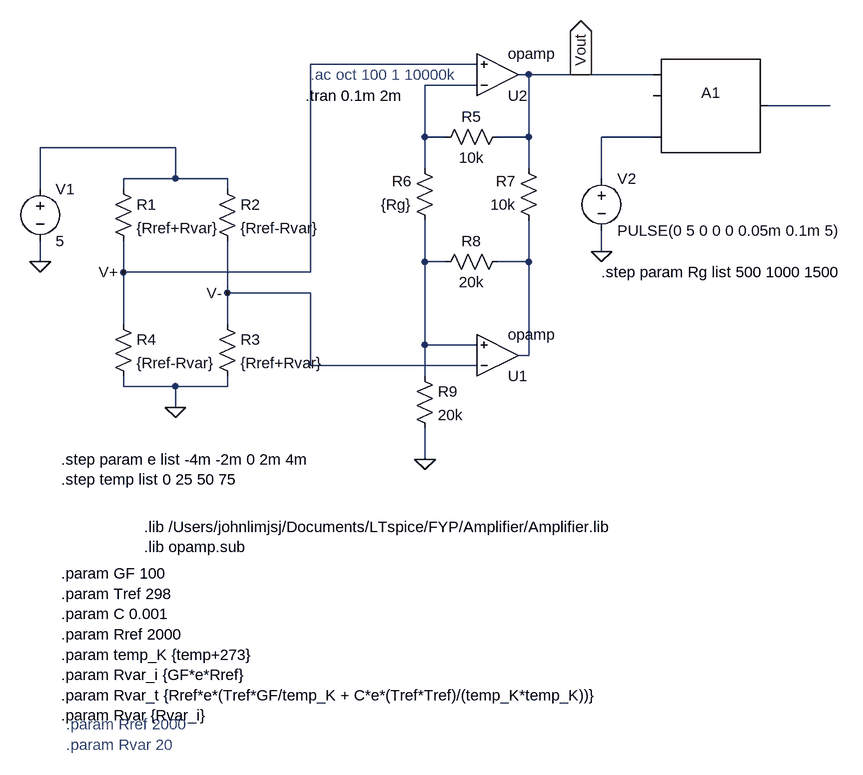
[diagram p0: schematic PZR_INA.asc]
PZR_INA.asc, the LTspice schematic file:
Version 4
SHEET 1 1700 1020
WIRE 704 -32 448 -32
WIRE 784 -16 768 -16
WIRE 864 -16 784 -16
WIRE 976 -16 864 -16
WIRE 704 0 624 0
WIRE 1248 32 1152 32
WIRE 624 80 624 0
WIRE 656 80 624 80
WIRE 784 80 784 -16
WIRE 784 80 736 80
WIRE 976 80 896 80
WIRE 240 96 32 96
WIRE 624 128 624 80
WIRE 784 128 784 80
WIRE 240 144 240 96
WIRE 240 144 160 144
WIRE 320 144 240 144
WIRE 896 144 896 80
WIRE 32 160 32 96
WIRE 160 160 160 144
WIRE 320 160 320 144
WIRE 896 256 896 224
WIRE 32 272 32 240
WIRE 624 272 624 208
WIRE 656 272 624 272
WIRE 784 272 784 208
WIRE 784 272 736 272
WIRE 160 288 160 240
WIRE 448 288 448 -32
WIRE 448 288 160 288
WIRE 320 320 320 240
WIRE 448 320 320 320
WIRE 160 368 160 288
WIRE 320 368 320 320
WIRE 624 400 624 272
WIRE 704 400 624 400
WIRE 784 416 784 272
WIRE 784 416 768 416
WIRE 448 432 448 320
WIRE 704 432 448 432
WIRE 624 448 624 400
WIRE 160 464 160 448
WIRE 240 464 160 464
WIRE 320 464 320 448
WIRE 320 464 240 464
WIRE 240 496 240 464
WIRE 624 576 624 528
FLAG 32 272 0
FLAG 624 576 0
FLAG 864 -16 Vout
IOPIN 864 -16 Out
FLAG 240 496 0
FLAG 160 288 V+
FLAG 320 320 V-
FLAG 896 256 0
SYMBOL res 144 144 R0
SYMATTR InstName R1
SYMATTR Value {Rref+Rvar}
SYMBOL res 304 144 R0
SYMATTR InstName R2
SYMATTR Value {Rref-Rvar}
SYMBOL res 304 352 R0
SYMATTR InstName R3
SYMATTR Value {Rref+Rvar}
SYMBOL res 144 352 R0
SYMATTR InstName R4
SYMATTR Value {Rref-Rvar}
SYMBOL voltage 32 144 R0
SYMATTR InstName V1
SYMATTR Value 5
SYMATTR Value2 AC 10
SYMBOL Opamps/opamp 736 480 M180
SYMATTR InstName U1
SYMBOL Opamps/opamp 736 48 M180
SYMATTR InstName U2
SYMBOL res 752 64 R90
WINDOW 0 0 56 VBottom 2
WINDOW 3 32 56 VTop 2
SYMATTR InstName R5
SYMATTR Value 10k
SYMBOL res 640 224 R180
WINDOW 0 36 76 Left 2
WINDOW 3 36 40 Left 2
SYMATTR InstName R6
SYMATTR Value {Rg}
SYMBOL res 800 224 R180
WINDOW 0 36 76 Left 2
WINDOW 3 36 40 Left 2
SYMATTR InstName R7
SYMATTR Value 10k
SYMBOL res 640 288 R270
WINDOW 0 32 56 VTop 2
WINDOW 3 0 56 VBottom 2
SYMATTR InstName R8
SYMATTR Value 20k
SYMBOL res 608 432 R0
SYMATTR InstName R9
SYMATTR Value 20k
SYMBOL SpecialFunctions/sample 1056 16 R0
SYMATTR InstName A1
SYMBOL voltage 896 128 R0
SYMATTR InstName V2
SYMATTR Value PULSE(0 5 0 0 0 0.05m 0.1m 5)
SYMATTR Value2 AC 10
TEXT 192 680 Left 2 !.lib /Users/johnlimjsj/Documents/LTspice/FYP/Amplifier/Amplifier.lib\n.lib opamp.sub
TEXT 72 984 Left 2 ;.param Rref 2000\n.param Rvar 20
TEXT 440 16 Left 2 !.tran 0.1m 2m
TEXT 448 -16 Left 2 ;.ac oct 100 1 10000k
TEXT 64 576 Left 2 !.step param e list -4m -2m 0 2m 4m\n.step temp list 0 25 50 75
TEXT 64 752 Left 2 !.param GF 100\n.param Tref 298\n.param C 0.001\n.param Rref 2000\n.param temp_K {temp+273}\n.param Rvar_i {GF*e*Rref}\n.param Rvar_t {Rref*e*(Tref*GF/temp_K + C*e*(Tref*Tref)/(temp_K*temp_K))}\n.param Rvar {Rvar_i}
TEXT 896 288 Left 2 !.step param Rg list 500 1000 1500

The netlist it stands for:
* PZR_INA.asc
R1 N004 V+ {Rref+Rvar}
R2 N004 V- {Rref-Rvar}
R3 V- 0 {Rref+Rvar}
R4 V+ 0 {Rref-Rvar}
V1 N004 0 5 AC 10
XU1 V- N005 N006 opamp Aol=100K GBW=10Meg  ; pins invin noninvin out
XU2 N001 V+ Vout opamp Aol=100K GBW=10Meg  ; pins invin noninvin out
R5 Vout N001 10k
R6 N005 N001 {Rg}
R7 N006 Vout 10k
R8 N005 N006 20k
R9 N005 0 20k
A1 Vout 0 0 N003 0 0 N002 0 SAMPLEHOLD
V2 N003 0 PULSE(0 5 0 0 0 0.05m 0.1m 5) AC 10
.lib /Users/johnlimjsj/Documents/LTspice/FYP/Amplifier/Amplifier.lib
.lib opamp.sub
* .param Rref 2000
* .param Rvar 20
.tran 0.1m 2m
* .ac oct 100 1 10000k
.step param e list -4m -2m 0 2m 4m
.step temp list 0 25 50 75
.param GF 100
.param Tref 298
.param C 0.001
.param Rref 2000
.param temp_K {temp+273}
.param Rvar_i {GF*e*Rref}
.param Rvar_t {Rref*e*(Tref*GF/temp_K + C*e*(Tref*Tref)/(temp_K*temp_K))}
.param Rvar {Rvar_i}
.step param Rg list 500 1000 1500
.backanno
.end